# EAGLE design FabEEG_v5 (EAGLE 6.2)
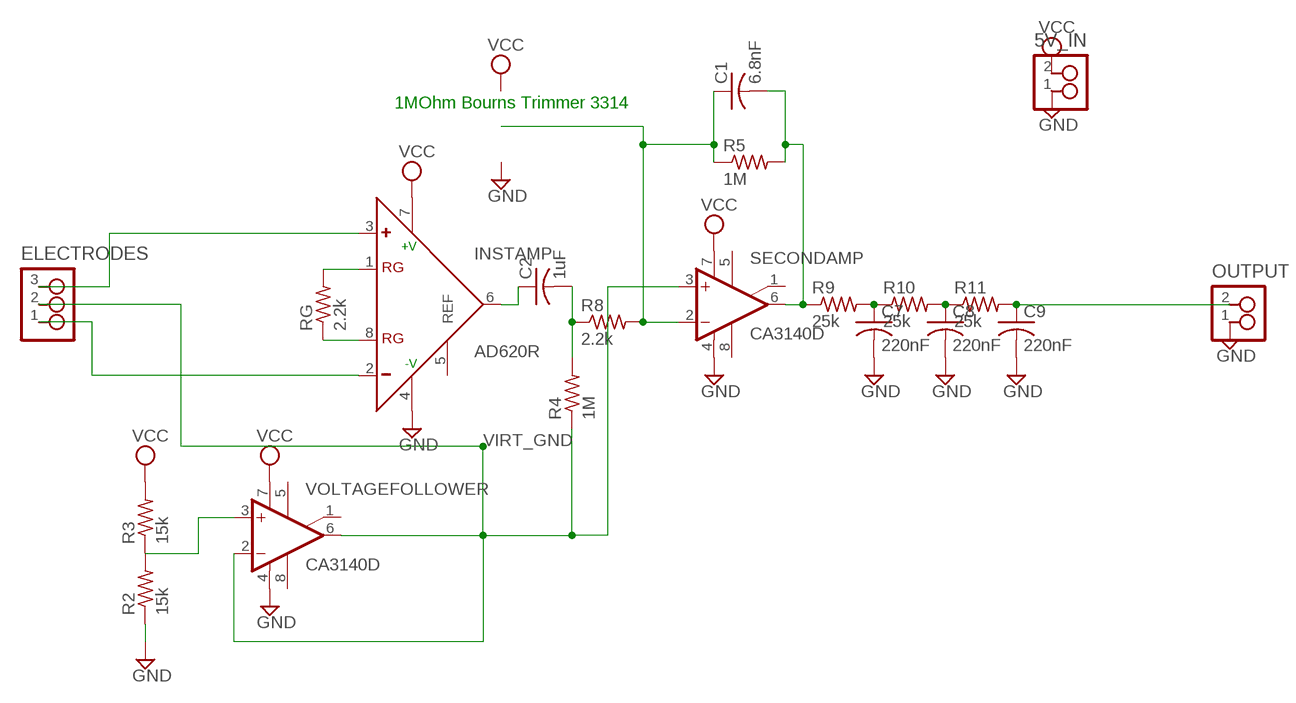
[diagram p0: schematic, sheet 1]

## Parts
5V_IN  2_PIN_HEADERHEADER  [SMT_PINS_2]
C1  6.8nF  C-USC1206  [C1206]
C2  1uF  C-USC1206  [C1206]
C7  220nF  C-USC1206  [C1206]
C8  220nF  C-USC1206  [C1206]
C9  220nF  C-USC1206  [C1206]
ELECTRODES  3_PIN_HEADERHEADER  [SMT_PINS_3]
INSTAMP  AD620R  [SO8]
OUTPUT  2_PIN_HEADERHEADER  [SMT_PINS_2]
R2  15k  R-US_R1206  [R1206]
R3  15k  R-US_R1206  [R1206]
R4  1M  R-US_R1206  [R1206]
R5  1M  R-US_R1206  [R1206]
R8  2.2k  R-US_R1206  [R1206]
R9  25k  R-US_R1206  [R1206]
R10  25k  R-US_R1206  [R1206]
R11  25k  R-US_R1206  [R1206]
RG  2.2k  R-US_R1206  [R1206]
SECONDAMP  CA3140D  [SO08]
VOLTAGEFOLLOWER  CA3140D  [SO08]

## Nets
GND: 5V_IN.1 C7.2 C8.2 C9.2 INSTAMP.4(-V) OUTPUT.1 R2.1 SECONDAMP.4(V-) VOLTAGEFOLLOWER.4(V-)
N$1: INSTAMP.1(RG) RG.2
N$2: INSTAMP.8(RG) RG.1
N$3: ELECTRODES.3 INSTAMP.3(+)
N$4: C1.2 R5.2 R9.1 SECONDAMP.6(OUT)
N$5: C1.1 R5.1 R8.2 SECONDAMP.2(-IN)
N$6: R2.2 R3.1 VOLTAGEFOLLOWER.3(+IN)
N$8: C2.1 INSTAMP.6(OUT)
N$9: C2.2 R4.2 R8.1
N$12: C7.1 R9.2 R10.1
N$15: ELECTRODES.1 INSTAMP.2(-)
N$20: C8.1 R10.2 R11.1
N$25: C9.1 OUTPUT.2 R11.2
VCC: 5V_IN.2 INSTAMP.7(+V) R3.2 SECONDAMP.7(V+) VOLTAGEFOLLOWER.7(V+)
VIRT_GND: ELECTRODES.2 R4.1 SECONDAMP.3(+IN) VOLTAGEFOLLOWER.2(-IN) VOLTAGEFOLLOWER.6(OUT)
Unconnected: INSTAMP.5(REF) SECONDAMP.1(ON/CMP) SECONDAMP.5(ON) SECONDAMP.8(CMP) VOLTAGEFOLLOWER.1(ON/CMP) VOLTAGEFOLLOWER.5(ON) VOLTAGEFOLLOWER.8(CMP)

## Notes on the sheet
- 1MOhm Bourns Trimmer 3314

## Library data of the parts
5V_IN OUTPUT = ng:2_PIN_HEADER: 2 SMT pin pads
C1 C2 C7-C9 = rcl:C-US: CAPACITOR, American symbol
ELECTRODES = ng:3_PIN_HEADER: 3 SMT pin pads
INSTAMP = analog-devices:AD620: Low Cost, Low Power, Instrumentation Amplifier Source: http://www.analog.com/UploadedFiles/Data_Sheets/37793330023930AD620_e.pdf
R2-R5 R8-R11 RG = resistor:R-US_: RESISTOR, American symbol
SECONDAMP VOLTAGEFOLLOWER = linear:CA3140: OP AMP

## Net classes
0 default: drill 0.813 mm

## Board
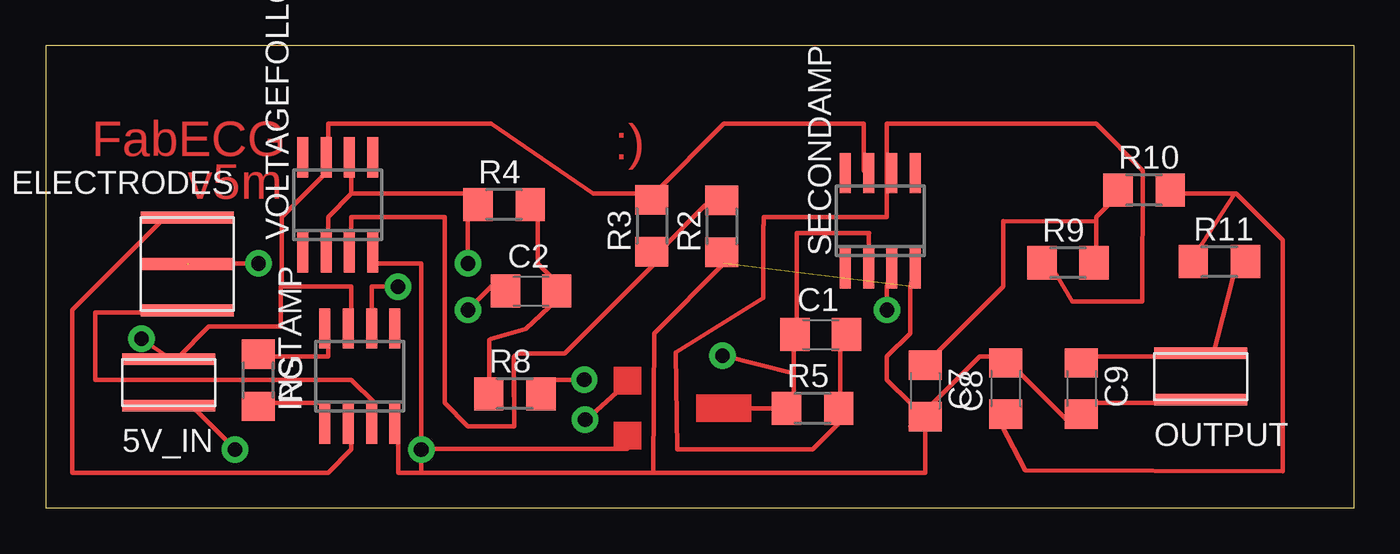
[diagram p1: board, top side]
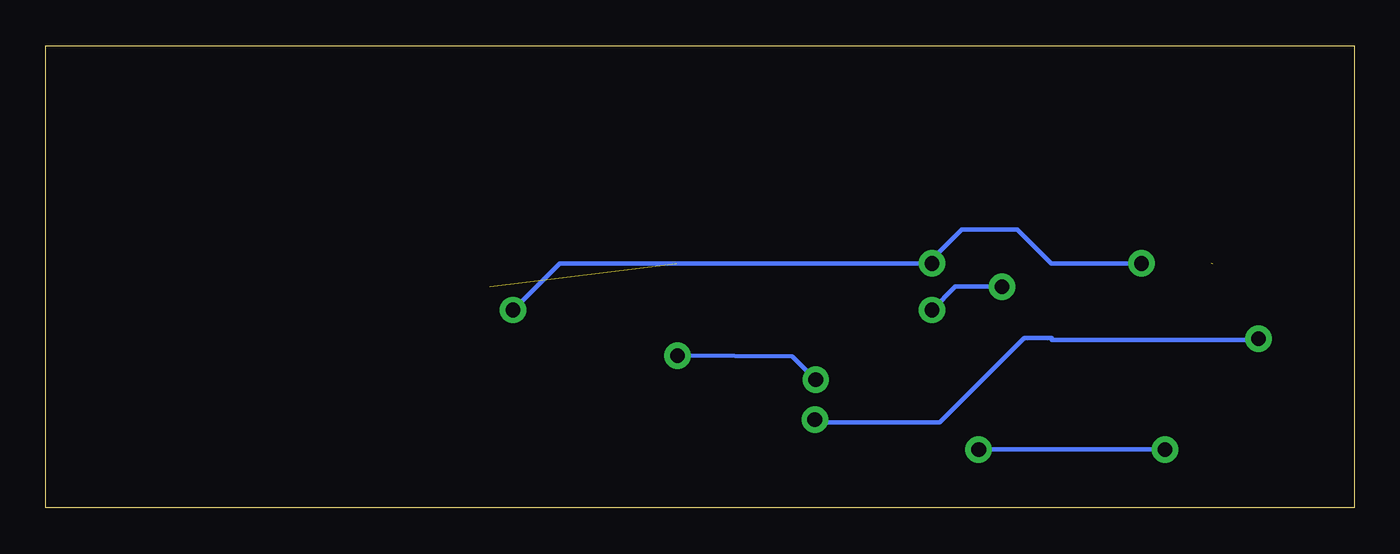
[diagram p2: board, bottom side, seen from below]

Size 71.38 x 25.23 mm. Coordinates in mm from the lower left corner, seen from the top.
Outline: 0,0 71.38,0 71.38,25.23 0,25.23 0,0
Copper layers (1*16): Top 0.035mm / dielectric 1.5mm / Bottom 0.035mm
Design rules: minimum track width 10mil, minimum drill 32mil, track to track 16mil, track to pad 16mil, pad to pad 16mil, via to via 16mil, smd to smd 8mil, copper to edge 40mil, drill to drill 8mil, minimum pad ring 10mil, minimum via ring 0mil, stop-mask expansion 4mil, vias tented up to drill 0mil, thermal gap 10mil

### Footprints (pad centres in the part's own frame; a part is rotated, then mirrored left to right if it is on the bottom)
SMT_PINS_2 = smd 5.08 x 0.635: 1 0,0; 2 0,2.54
C1206 = smd 1.6 x 1.8: 1 -1.4,0; 2 1.4,0
SMT_PINS_3 = smd 5.08 x 0.635: 1 0,0; 2 0,2.54; 3 0,5.08
SO8 = smd 0.6 x 2.2: 1 -1.905,-2.6; 2 -0.635,-2.6; 3 0.635,-2.6; 4 1.905,-2.6; 5 1.905,2.6; 6 0.635,2.6; 7 -0.635,2.6; 8 -1.905,2.6
R1206 = smd 1.6 x 1.803: 1 -1.422,0; 2 1.422,0
SO08 = smd 0.6 x 2.2: 1 -1.905,-2.6; 2 -0.635,-2.6; 3 0.635,-2.6; 4 1.905,-2.6; 5 1.905,2.6; 6 0.635,2.6; 7 -0.635,2.6; 8 -1.905,2.6

### Placement (x,y rotation side)
5V_IN  6.7,5.57 0 top
C1  42.27,9.45 0 top
C2  26.47,11.83 0 top
C7  47.98,6.38 270 top
C8  52.38,6.51 90 top
C9  56.5,6.51 270 top
ELECTRODES  7.71,15.85 180 top
INSTAMP  17.13,7.19 0 top
OUTPUT  63.01,5.9 0 top
R2  36.87,15.37 90 top
R3  33.07,15.39 90 top
R4  25,16.55 0 top
R5  41.84,5.43 0 top
R8  25.59,6.23 0 top
R9  55.77,13.38 0 top
R10  59.92,17.35 0 top
R11  64.02,13.43 0 top
RG  11.59,6.96 270 top
SECONDAMP  45.52,15.67 0 top
VOLTAGEFOLLOWER  15.93,16.54 0 top

### Tracks (layer width: path | path; a pad name or v marks a point on that pad's centre or on a via)
GND  (via drill 0.8)  (1 unrouted)
  Top 0.254: 52.23,8.26 50.96,8.26 48.42,5.72 C7.2 | SECONDAMP.4 47.15,12.07 47.15,9.53 45.88,8.26 45.88,6.99 47.15,5.72 C7.2 | OUTPUT.1 62.39,5.72 57.31,5.72 C9.2 56.04,4.45 52.23,8.26 | 52.23,8.26 C8.2 | 33.13,2.04 33.18,9.53 36.99,13.34 R2.1 | 20.48,1.91 19.21,1.91 19.21,4.45 INSTAMP.4 | 20.48,1.91 47.97,1.91 47.97,4.91 47.99,4.91 47.15,4.45 C7.2 | 20.48,1.91 v20.48,3.18 | v20.48,3.18 20.48,13.34 17.94,13.34 VOLTAGEFOLLOWER.4 | v10.32,3.18 7.78,5.72 5V_IN.1 | v20.48,3.18 20.48,3.21 31.71,3.21 31.71,3.97
  Bottom 0.254: v20.48,3.18 v10.32,3.18
N$1
  Top 0.254: RG.2 11.59,5.72 15.4,5.72 15.4,4.45 INSTAMP.1
N$2
  Top 0.254: RG.1 11.59,8.26 15.4,8.26 15.4,9.53 INSTAMP.8
N$3
  Top 0.254: 5.78,10.8 6.51,10.8 ELECTRODES.3 | 5.78,10.8 5.24,10.8 | INSTAMP.3 17.94,4.45 17.94,5.72 16.67,6.99 2.7,6.99 2.7,10.67 5.78,10.67 5.78,10.8
N$4
  Top 0.254: C1.2 43.34,9.53 43.34,5.72 R5.2 43.4,5.3 43.4,4.73 41.85,3.18 34.45,3.18 34.38,8.49 39.13,11.46 39.13,15.45 39.18,15.45 39.18,15.88 45.88,15.88 45.88,18.42 | 45.88,18.42 45.88,20.96 57.31,20.96 59.85,18.42 59.8,11.26 55.99,11.26 54.77,13.34 R9.1 | 45.88,18.42 SECONDAMP.6
N$5  (via drill 0.8)
  Top 0.254: 40.8,7.35 40.8,5.72 R5.1 | 40.8,7.35 40.8,9.53 C1.1 40.96,9.45 40.96,14.99 44.89,14.99 | v29.37,6.99 26.83,6.99 R8.2 | 40.8,7.35 v36.92,8.31 | 44.92,14.99 44.89,14.99 | 44.89,14.99 SECONDAMP.2
  Bottom 0.254: v29.37,6.99 30.64,8.26 v36.92,8.31
N$6
  Top 0.254: 36.99,17.15 R2.2 36.59,16.52 35.98,16.52 33.43,13.97 R3.1 33.21,13.83 33.21,13.34 28.31,8.44 25.74,8.44 25.54,8.24 25.54,6.08 25.56,6.05 | 25.56,7.12 25.56,6.05 | 25.56,6.05 25.56,4.45 23.02,4.45 21.75,5.72 21.75,15.88 16.67,15.88 16.67,14.61 VOLTAGEFOLLOWER.3
N$8  (via drill 0.8)
  Top 0.254: v23.02,10.8 24.29,12.07 C2.1 | INSTAMP.6 17.94,10.8 17.79,10.8 17.79,12.07 v19.21,12.07
  Bottom 0.254: v23.02,10.8 21.75,12.07 v19.21,12.07
N$9
  Top 0.254: R4.2 26.83,15.88 26.83,13.34 28.1,12.07 C2.2 27.87,11.35 26.17,9.76 24.27,9.23 24.19,9.15 24.19,6.25 R8.1
N$10
  Top 0.254: 6.77,8.16 5.32,9.17
N$12
  Top 0.254: 57.31,15.63 52.23,15.65 52.23,12.07 48.42,8.26 C7.1 | 57.31,15.63 57.31,13.34 R9.2 | 57.31,15.63 57.31,15.88 58.58,17.15 R10.1
N$14  (via drill 0.8)
  other vias: 5.22,9.23
N$15
  Top 0.254: INSTAMP.2 16.67,4.45 16.67,3.18 15.4,1.91 1.43,1.91 1.43,10.8 6.51,15.88 ELECTRODES.1
N$16  (via drill 0.8)
  other vias: 29.43,4.81
N$17
  Top 0.254: 31.46,6.58 29.48,4.81
N$18
  Bottom 0.254: 5.35,9.17 16.5,9.17 16.5,9.28 18,9.28 22.62,4.65 29.37,4.65 29.53,4.81
N$19
  Top 0.254: 38.14,5.42 40.22,5.42
N$20
  Top 0.254: 64.86,17.15 61.12,17.15 R10.2 | 64.86,17.15 64.93,17.15 67.47,14.61 67.47,1.99 53.43,2.04 52.16,4.5 52.23,4.45 C8.1 | 64.86,17.15 62.39,13.34 R11.1
N$25
  Top 0.254: C9.1 57.31,8.26 62.39,8.26 OUTPUT.2 63.66,8.26 65.04,13.57 64.93,13.34 R11.2
VCC
  Top 0.254: 33.18,17.15 36.99,20.96 44.61,20.96 44.61,18.42 SECONDAMP.7 | 12.86,12.07 12.86,15.88 15.4,18.42 VOLTAGEFOLLOWER.7 15.4,19.69 15.4,20.96 24.29,20.96 29.86,17.15 33.18,17.15 | 12.86,12.07 16.67,12.07 16.67,10.8 INSTAMP.7 | 7.78,8.26 7.2,8.18 | 7.2,8.18 5V_IN.2 | 33.18,17.15 R3.2 | 12.86,12.07 12.81,12.07 12.81,9.91 9,9.91 9,9.89 8.9,9.89 7.2,8.18
VIRT_GND  (via drill 0.8)  (1 unrouted)
  Top 0.254: 16.67,17.15 23.02,17.15 R4.1 23.02,15.88 v23.02,13.34 | 16.67,17.15 16.67,18.42 VOLTAGEFOLLOWER.6 | 16.67,17.15 15.4,15.88 15.4,14.61 VOLTAGEFOLLOWER.2 | v45.88,10.8 45.88,12.07 SECONDAMP.3 | v11.59,13.34 7.78,13.34
  Bottom 0.254: v45.88,10.8 43.34,13.34 v23.02,13.34 23.15,13.44 21.4,15.19 18.38,15.19 16.52,13.34 v11.59,13.34
(copper drawn outside any net)
  shapes: Top area x3

### Text on the board
Top: FabECG | :) | v5m